# EAGLE schematic esp8285 (EAGLE 9.6.2)
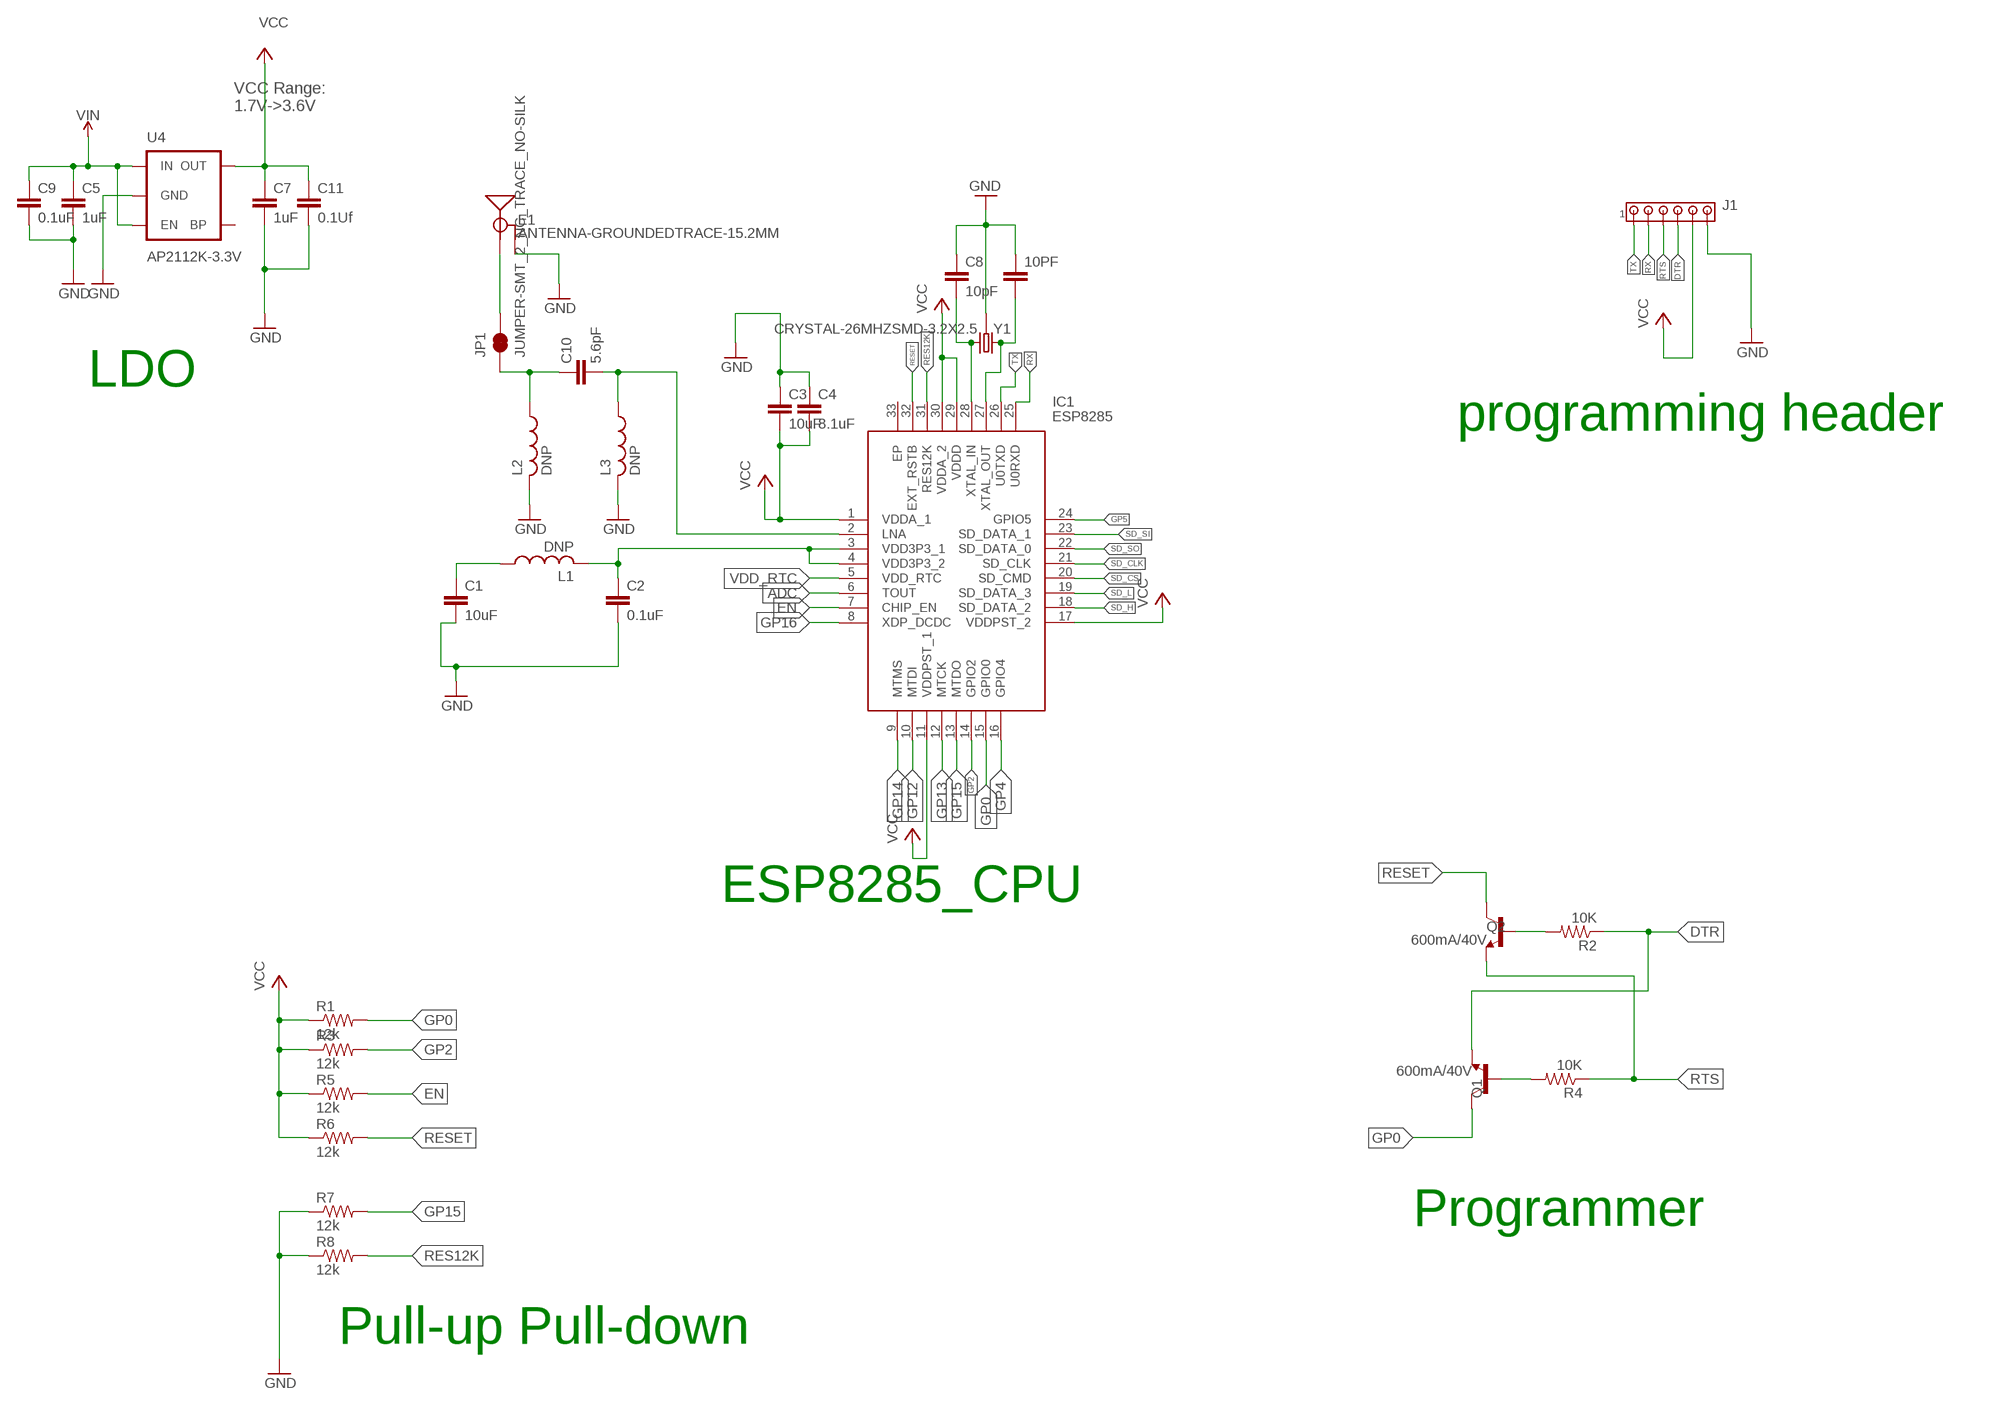
[diagram p0: schematic, sheet 1]

## Parts
10PF  C-EUC0603  [C0603]
C1  10uF  C-EUC0603  [C0603]
C2  0.1uF  C-EUC0603  [C0603]
C3  10uF  C-EUC0603  [C0603]
C4  8.1uF  C-EUC0603  [C0603]
C5  1uF  C-EUC0603  [C0603]
C7  1uF  C-EUC0603  [C0603]
C8  10pF  C-EUC0603  [C0603]
C9  0.1uF  C-EUC0603  [C0603]
C10  5.6pF  C-EUC0603  [C0603]
C11  0.1Uf  C-EUC0603  [C0603]
E1  ANTENNA-GROUNDEDTRACE-15.2MM  [TRACE_ANTENNA_2.4GHZ_15.2MM]
IC1  ESP8285  [QFN50P500X500X90-33N]
J1  MTA06-100  [10X06MTA]
JP1  JUMPER-SMT_2_NC_TRACE_NO-SILK  [SMT-JUMPER_2_NC_TRACE_NO-SILK]
L1  DNP  L-USL0603  [L0603]
L2  DNP  L-USL0603  [L0603]
L3  DNP  L-USL0603  [L0603]
Q1  600mA/40V  TRANS_NPN-MMBT2222AL  [SOT23-3]
Q2  600mA/40V  TRANS_NPN-MMBT2222AL  [SOT23-3]
R1  12k  R-US_R0805  [R0805]
R2  10K  R-US_R0805  [R0805]
R3  12k  R-US_R0805  [R0805]
R4  10K  R-US_R0805  [R0805]
R5  12k  R-US_R0805  [R0805]
R6  12k  R-US_R0805  [R0805]
R7  12k  R-US_R0805  [R0805]
R8  12k  R-US_R0805  [R0805]
U4  AP2112K-3.3V  V_REG_LDOSMD  [SOT23-5]
Y1  CRYSTAL-26MHZSMD-3.2X2.5  [CRYSTAL-SMD-3.2X2.5MM]

## Nets
ADC: IC1.6(TOUT)
DTR: J1.4 Q1.2(E) R2.1
EN: IC1.7(CHIP_EN) R5.2
GND: 10PF.1 C1.2 C2.2 C3.1 C4.1 C5.2 C7.2 C8.1 C9.2 C11.2 E1.GND J1.6 L2.2 L3.2 R7.1 R8.1 U4.2(GND) Y1.2 Y1.4
GP0: IC1.15(GPIO0) Q1.3(C) R1.2
GP2: IC1.14(GPIO2) R3.2
GP4: IC1.16(GPIO4)
GP5: IC1.24(GPIO5)
GP12: IC1.10(MTDI)
GP13: IC1.12(MTCK)
GP14: IC1.9(MTMS)
GP15: IC1.13(MTDO) R7.2
GP16: IC1.8(XDP_DCDC)
N$1: C8.2 IC1.28(XTAL_IN) Y1.3
N$2: C1.1 L1.1
N$3: C2.1 IC1.3(VDD3P3_1) IC1.4(VDD3P3_2) L1.2
N$4: C10.2 IC1.2(LNA) L3.1
N$5: C10.1 JP1.1 L2.1
N$6: E1.ANT(SIGNAL) JP1.2
N$7: 10PF.2 IC1.27(XTAL_OUT) Y1.1
N$8: Q1.1(B) R4.2
N$9: Q2.1(B) R2.2
RES12K: IC1.31(RES12K) R8.2
RESET: IC1.32(EXT_RSTB) Q2.3(C) R6.2
RTS: J1.3 Q2.2(E) R4.1
RX: IC1.25(U0RXD) J1.2
SD_CLK: IC1.21(SD_CLK)
SD_CS: IC1.20(SD_CMD)
SD_H: IC1.18(SD_DATA_2)
SD_L: IC1.19(SD_DATA_3)
SD_SI: IC1.23(SD_DATA_1)
SD_SO: IC1.22(SD_DATA_0)
TX: IC1.26(U0TXD) J1.1
VCC: C3.2 C4.2 C7.1 C11.1 IC1.1(VDDA_1) IC1.11(VDDPST_1) IC1.17(VDDPST_2) IC1.29(VDDD) IC1.30(VDDA_2) J1.5 R1.1 R3.1 R5.1 R6.1 U4.5(OUT)
VDD_RTC: IC1.5(VDD_RTC)
VIN: C5.1 C9.1 U4.1(IN) U4.3(EN)
Unconnected: IC1.33(EP) U4.4(BP)

## Notes on the sheet
- VCC Range:
  1.7V->3.6V
- LDO
- programming header
- ESP8285_CPU
- Programmer
- Pull-up Pull-down

## Library data of the parts
10PF C1-C5 C7-C11 = rcl:C-EU: CAPACITOR, European symbol; SPICEPREFIX: C
E1 = SparkFun-RF:ANTENNA-GROUNDED: Antenna w/ Ground Connection 2.4GHz antennae with signal and ground terminals. TRACE_ANTENNA_2.4GHZ_15.2MM - Meander Trace antenna 15.2 x 5.7mm footprint Based on layout from TI app note AN043 <http://www.ti.com/lit/an/swra117d/swra117d.pdf>. TRACE_ANTENNA_2.4GHZ_25.7MM - Inverted F trace antenna 25.7 x 7.5 mm footprint. Based on layout from TI design note DN0007 <http://www.ti.com/lit/an/swru120b/swru120b.pdf>.
IC1 = SamacSys_Parts:ESP8285: Wi-Fi SoC, qfn-32 Source: Datasheet <https://kr.mouser.com/datasheet/2/891/0a-esp8285_datasheet_en-1223891.pdf>; DESCRIPTION: Wi-Fi SoC, qfn-32; HEIGHT: 0.9mm; MANUFACTURER_NAME: Espressif; MANUFACTURER_PART_NUMBER: ESP8285; MOUSER_PART_NUMBER: 356-ESP8285
J1 = con-amp:MTA06-100: AMP connector Connection corrected 2014-09-19
JP1 = SparkFun-Jumpers:JUMPER-SMT_2_NC_TRACE: Normally closed trace jumper This jumper has a trace between two pads so it's normally closed (NC). Use a razor knife to open the connection. For best results follow the IPC guidelines for cutting traces: Cutout at least 0.063 mm (0.005 in). Remove all loose material to clean up the cut area. Seal the cut with an approved epoxy. Reapply solder to reclose the connection.
L1-L3 = rcl-2:L-US: INDUCTOR, American symbol
Q1 Q2 = SparkFun-DiscreteSemi:TRANS_NPN: NPN transistor Current controlled devices typically used to amplify current or used as a switch. BC547 - COM-08928 <http://www.sparkfun.com/products/8928> (TO-92 45V 100mA) (1.Collector 2.Base 3.Emitter) 2N3904 - COM-00521 <http://www.sparkfun.com/products/521> (TO-92 40V 200mA) (1.Emitter 2.Base 3.Collector) P2N2222A - COM-12852 <http://www.sparkfun.com/products/12852> (TO-92 40V 600mA) (1.Collector 2.Base 3.Emitter); PROD_ID: TRANS-08049
R1 R3 R5-R8 = rcl-2:R-US_: RESISTOR, American symbol
R2 R4 = rcl:R-US_: RESISTOR, American symbol; SPICEPREFIX: R
U4 = SparkFun-PowerIC:V_REG_LDO: Voltage Regulator LDO Standard 150mA LDO voltage regulator in SOT-23 layout. Micrel part MIC5205. BP (by-pass) pin is used to lower output noise with 470pF cap.; PROD_ID: VREG-12457
Y1 = SparkFun-Clocks:CRYSTAL-26MHZ: 26MHz Crystal w/ Ground Pin Digikey Example <http://www.digikey.com/product-detail/en/epson/TSX-3225%2026.0000MF09Z-AC3/SER3627CT-ND/1802878> Frequency: 26MHz Frequency Stability: ±9ppm Frequency Tolerance: ±10ppm Load Capacitance: 9pF SparkFun Products: SparkFun ESP32 Thing <https://www.sparkfun.com/products/13907> SparkFun ESP8266 Thing Dev Board <https://www.sparkfun.com/products/13711>; PROD_ID: XTAL-12454